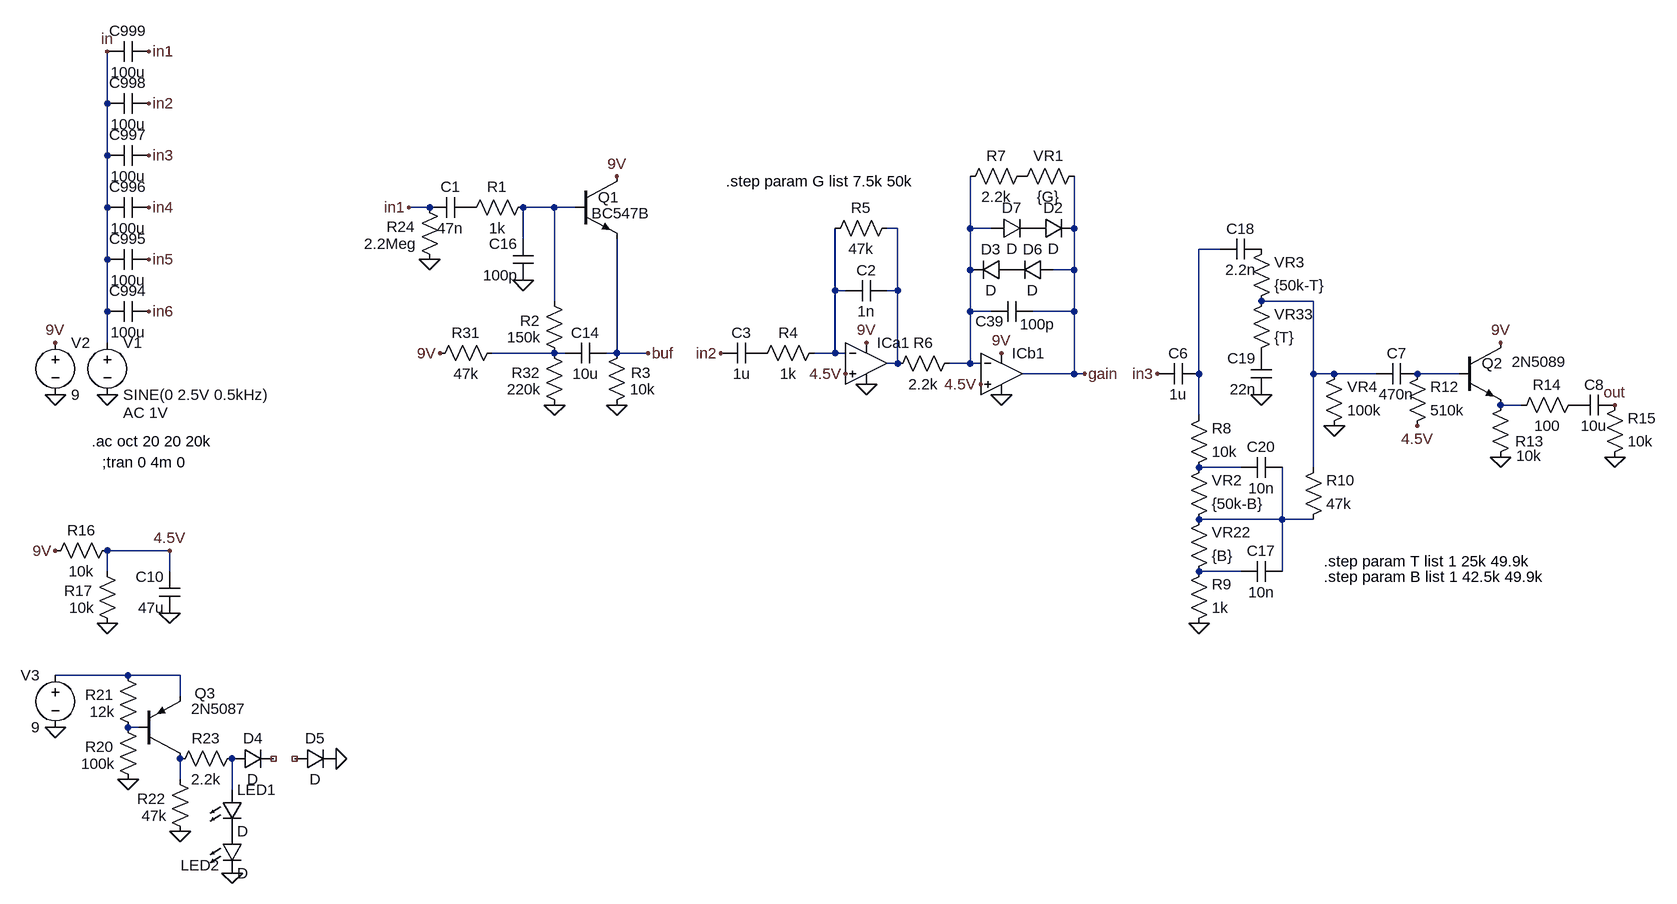
[diagram p0: schematic iron_forest.asc]
iron_forest.asc, the LTspice schematic file:
Version 4
SHEET 1 3200 3460
WIRE -1568 704 -1568 624
WIRE -1568 784 -1568 704
WIRE -1568 864 -1568 784
WIRE -1072 864 -1104 864
WIRE -880 864 -928 864
WIRE -848 864 -880 864
WIRE -352 896 -368 896
WIRE -240 896 -240 816
WIRE -208 896 -240 896
WIRE -80 896 -80 816
WIRE -928 912 -928 864
WIRE 144 928 112 928
WIRE -1568 944 -1568 864
WIRE -240 960 -240 896
WIRE -80 960 -80 896
WIRE -80 960 -112 960
WIRE -448 992 -448 896
WIRE -432 992 -448 992
WIRE -352 992 -352 896
WIRE -352 992 -368 992
WIRE -880 1008 -880 864
WIRE 288 1008 208 1008
WIRE -1568 1024 -1568 944
WIRE -240 1024 -240 960
WIRE -208 1024 -240 1024
WIRE -80 1024 -80 960
WIRE -80 1024 -144 1024
WIRE -1568 1072 -1568 1024
WIRE -880 1088 -976 1088
WIRE -864 1088 -880 1088
WIRE -784 1088 -784 912
WIRE -784 1088 -800 1088
WIRE -736 1088 -784 1088
WIRE -448 1088 -448 992
WIRE -448 1088 -480 1088
WIRE -432 1088 -448 1088
WIRE -352 1104 -352 992
WIRE -352 1104 -368 1104
WIRE -240 1104 -240 1024
WIRE -240 1104 -272 1104
WIRE -224 1104 -240 1104
WIRE -80 1120 -80 1024
WIRE -80 1120 -160 1120
WIRE -64 1120 -80 1120
WIRE 112 1120 112 928
WIRE 288 1120 288 1008
WIRE 320 1120 288 1120
WIRE 384 1120 320 1120
WIRE 512 1120 448 1120
WIRE 608 1168 576 1168
WIRE 112 1184 112 1120
WIRE 176 1264 112 1264
WIRE 288 1264 288 1120
WIRE 240 1344 240 1264
WIRE 240 1344 112 1344
WIRE 288 1344 240 1344
WIRE -1472 1392 -1568 1392
WIRE -1568 1424 -1568 1392
WIRE -1472 1424 -1472 1392
WIRE 176 1424 112 1424
WIRE 240 1424 240 1344
WIRE -1536 1584 -1648 1584
WIRE -1456 1584 -1536 1584
WIRE -1456 1616 -1456 1584
WIRE -1520 1664 -1536 1664
WIRE -1456 1744 -1456 1712
WIRE -1376 1760 -1376 1712
FLAG -1568 1152 0
FLAG -1568 624 in
FLAG -1648 1152 0
FLAG -1648 1072 9V
FLAG -1504 624 in1
FLAG -1504 704 in2
FLAG -1504 784 in3
FLAG -1504 864 in4
FLAG -1504 944 in5
FLAG -1504 1024 in6
FLAG -1072 944 0
FLAG -1104 864 in1
FLAG 208 1152 0
FLAG 48 1120 in3
FLAG 112 1504 0
FLAG 320 1200 0
FLAG -928 976 0
FLAG -880 1168 0
FLAG -784 1168 0
FLAG -784 816 9V
FLAG -1056 1088 9V
FLAG -1648 1392 9V
FLAG -1568 1504 0
FLAG -1472 1488 0
FLAG -1472 1392 4.5V
FLAG -432 1120 4.5V
FLAG -400 1072 9V
FLAG -400 1136 0
FLAG -224 1136 4.5V
FLAG -192 1088 9V
FLAG -192 1152 0
FLAG 448 1200 4.5V
FLAG 576 1072 9V
FLAG 576 1248 0
FLAG 752 1248 0
FLAG -624 1088 in2
FLAG -736 1088 buf
FLAG -64 1120 gain
FLAG 752 1168 out
FLAG -1536 1744 0
FLAG -1456 1824 0
FLAG -1216 1712 0
FLAG -1376 1888 0
FLAG -1648 1664 0
SYMBOL voltage -1568 1056 R0
WINDOW 123 24 124 Left 2
WINDOW 39 0 0 Left 2
SYMATTR Value2 AC 1V
SYMATTR InstName V1
SYMATTR Value SINE(0 2.5V 0.5kHz)
SYMBOL voltage -1648 1056 R0
WINDOW 123 0 0 Left 0
WINDOW 39 0 0 Left 0
SYMATTR InstName V2
SYMATTR Value 9
SYMBOL cap -1504 688 R90
WINDOW 0 0 32 VBottom 2
WINDOW 3 32 32 VTop 2
SYMATTR InstName C998
SYMATTR Value 100u
SYMBOL cap -1504 768 R90
WINDOW 0 0 32 VBottom 2
WINDOW 3 32 32 VTop 2
SYMATTR InstName C997
SYMATTR Value 100u
SYMBOL cap -1504 848 R90
WINDOW 0 0 32 VBottom 2
WINDOW 3 32 32 VTop 2
SYMATTR InstName C996
SYMATTR Value 100u
SYMBOL cap -1504 608 R90
WINDOW 0 0 32 VBottom 2
WINDOW 3 32 32 VTop 2
SYMATTR InstName C999
SYMATTR Value 100u
SYMBOL cap -1504 928 R90
WINDOW 0 0 32 VBottom 2
WINDOW 3 32 32 VTop 2
SYMATTR InstName C995
SYMATTR Value 100u
SYMBOL cap -1504 1008 R90
WINDOW 0 0 32 VBottom 2
WINDOW 3 32 32 VTop 2
SYMATTR InstName C994
SYMATTR Value 100u
SYMBOL cap -1008 848 R90
WINDOW 0 0 32 VBottom 2
WINDOW 3 32 32 VTop 2
SYMATTR InstName C1
SYMATTR Value 47n
SYMBOL res -1056 960 R180
WINDOW 0 38 66 Left 2
WINDOW 3 36 40 Left 2
SYMATTR InstName R24
SYMATTR Value 2.2Meg
SYMBOL npn -848 816 R0
WINDOW 0 35 32 Left 2
WINDOW 3 25 57 Left 2
SYMATTR InstName Q1
SYMATTR Value BC547B
SYMBOL cap 112 1104 R90
WINDOW 0 0 32 VBottom 2
WINDOW 3 32 32 VTop 2
SYMATTR InstName C6
SYMATTR Value 1u
SYMBOL cap 208 912 R90
WINDOW 0 0 32 VBottom 2
WINDOW 3 32 32 VTop 2
SYMATTR InstName C18
SYMATTR Value 2.2n
SYMBOL res 192 1024 M180
WINDOW 0 36 76 Left 2
WINDOW 3 36 40 Left 2
SYMATTR InstName VR3
SYMATTR Value {50k-T}
SYMBOL res 192 1104 M180
WINDOW 0 36 76 Left 2
WINDOW 3 36 40 Left 2
SYMATTR InstName VR33
SYMATTR Value {T}
SYMBOL cap 224 1152 R180
WINDOW 0 24 56 Left 2
WINDOW 3 24 8 Left 2
SYMATTR InstName C19
SYMATTR Value 22n
SYMBOL res 96 1280 M180
WINDOW 0 36 76 Left 2
WINDOW 3 36 40 Left 2
SYMATTR InstName R8
SYMATTR Value 10k
SYMBOL res 96 1360 M180
WINDOW 0 36 76 Left 2
WINDOW 3 36 40 Left 2
SYMATTR InstName VR2
SYMATTR Value {50k-B}
SYMBOL res 96 1440 M180
WINDOW 0 36 76 Left 2
WINDOW 3 36 40 Left 2
SYMATTR InstName VR22
SYMATTR Value {B}
SYMBOL res 96 1520 M180
WINDOW 0 36 76 Left 2
WINDOW 3 36 40 Left 2
SYMATTR InstName R9
SYMATTR Value 1k
SYMBOL cap 240 1248 R90
WINDOW 0 0 32 VBottom 2
WINDOW 3 32 32 VTop 2
SYMATTR InstName C20
SYMATTR Value 10n
SYMBOL cap 240 1408 R90
WINDOW 0 0 32 VBottom 2
WINDOW 3 32 32 VTop 2
SYMATTR InstName C17
SYMATTR Value 10n
SYMBOL res 304 1216 M180
WINDOW 0 36 76 Left 2
WINDOW 3 36 40 Left 2
SYMATTR InstName VR4
SYMATTR Value 100k
SYMBOL res 272 1360 M180
WINDOW 0 36 76 Left 2
WINDOW 3 36 40 Left 2
SYMATTR InstName R10
SYMATTR Value 47k
SYMBOL res -912 848 R90
WINDOW 0 0 56 VBottom 2
WINDOW 3 32 56 VTop 2
SYMATTR InstName R1
SYMATTR Value 1k
SYMBOL cap -912 976 R180
WINDOW 0 24 56 Left 2
WINDOW 3 24 8 Left 2
SYMATTR InstName C16
SYMATTR Value 100p
SYMBOL res -960 1072 R90
WINDOW 0 0 56 VBottom 2
WINDOW 3 32 56 VTop 2
SYMATTR InstName R31
SYMATTR Value 47k
SYMBOL res -864 1184 R180
WINDOW 0 38 66 Left 2
WINDOW 3 36 40 Left 2
SYMATTR InstName R32
SYMATTR Value 220k
SYMBOL cap -800 1072 R90
WINDOW 0 0 32 VBottom 2
WINDOW 3 32 32 VTop 2
SYMATTR InstName C14
SYMATTR Value 10u
SYMBOL res -800 1184 M180
WINDOW 0 38 66 Left 2
WINDOW 3 36 40 Left 2
SYMATTR InstName R3
SYMATTR Value 10k
SYMBOL cap -560 1072 R90
WINDOW 0 0 32 VBottom 2
WINDOW 3 32 32 VTop 2
SYMATTR InstName C3
SYMATTR Value 1u
SYMBOL res -464 1072 R90
WINDOW 0 0 56 VBottom 2
WINDOW 3 32 56 VTop 2
SYMATTR InstName R4
SYMATTR Value 1k
SYMBOL Opamps\\UniversalOpamp2 -400 1104 R0
SYMATTR InstName ICa1
SYMBOL res -1552 1376 R90
WINDOW 0 0 56 VBottom 2
WINDOW 3 32 56 VTop 2
SYMATTR InstName R16
SYMATTR Value 10k
SYMBOL res -1552 1520 R180
WINDOW 0 38 66 Left 2
WINDOW 3 36 40 Left 2
SYMATTR InstName R17
SYMATTR Value 10k
SYMBOL cap -1456 1488 R180
WINDOW 0 24 56 Left 2
WINDOW 3 24 8 Left 2
SYMATTR InstName C10
SYMATTR Value 47u
SYMBOL cap -368 976 R90
WINDOW 0 0 32 VBottom 2
WINDOW 3 32 32 VTop 2
SYMATTR InstName C2
SYMATTR Value 1n
SYMBOL res -352 880 R90
WINDOW 0 0 56 VBottom 2
WINDOW 3 32 56 VTop 2
SYMATTR InstName R5
SYMATTR Value 47k
SYMBOL res -256 1088 R90
WINDOW 0 0 56 VBottom 2
WINDOW 3 32 56 VTop 2
SYMATTR InstName R6
SYMATTR Value 2.2k
SYMBOL Opamps\\UniversalOpamp2 -192 1120 R0
SYMATTR InstName ICb1
SYMBOL cap -144 1008 R90
WINDOW 0 47 66 VBottom 2
WINDOW 3 20 -7 VTop 2
SYMATTR InstName C39
SYMATTR Value 100p
SYMBOL res -144 800 R90
WINDOW 0 0 56 VBottom 2
WINDOW 3 32 56 VTop 2
SYMATTR InstName R7
SYMATTR Value 2.2k
SYMBOL diode -208 912 R270
WINDOW 0 32 32 VTop 2
WINDOW 3 0 32 VBottom 2
SYMATTR InstName D7
SYMBOL diode -144 912 R270
WINDOW 0 32 32 VTop 2
WINDOW 3 0 32 VBottom 2
SYMATTR InstName D2
SYMBOL diode -176 976 M270
WINDOW 0 32 32 VTop 2
WINDOW 3 0 32 VBottom 2
SYMATTR InstName D3
SYMBOL diode -112 976 M270
WINDOW 0 32 32 VTop 2
WINDOW 3 0 32 VBottom 2
SYMATTR InstName D6
SYMBOL res -64 800 R90
WINDOW 0 0 56 VBottom 2
WINDOW 3 32 56 VTop 2
SYMATTR InstName VR1
SYMATTR Value {G}
SYMBOL cap 448 1104 R90
WINDOW 0 0 32 VBottom 2
WINDOW 3 32 32 VTop 2
SYMATTR InstName C7
SYMATTR Value 470n
SYMBOL res 432 1216 M180
WINDOW 0 36 76 Left 2
WINDOW 3 36 40 Left 2
SYMATTR InstName R12
SYMATTR Value 510k
SYMBOL npn 512 1072 R0
WINDOW 0 35 32 Left 2
WINDOW 3 81 29 Left 2
SYMATTR InstName Q2
SYMATTR Value 2N5089
SYMBOL res 560 1264 M180
WINDOW 0 39 40 Left 2
WINDOW 3 40 18 Left 2
SYMATTR InstName R13
SYMATTR Value 10k
SYMBOL res 704 1152 R90
WINDOW 0 0 56 VBottom 2
WINDOW 3 32 56 VTop 2
SYMATTR InstName R14
SYMATTR Value 100
SYMBOL cap 752 1152 R90
WINDOW 0 0 32 VBottom 2
WINDOW 3 32 32 VTop 2
SYMATTR InstName C8
SYMATTR Value 10u
SYMBOL res 736 1264 M180
WINDOW 0 36 76 Left 2
WINDOW 3 36 40 Left 2
SYMATTR InstName R15
SYMATTR Value 10k
SYMBOL res -864 1104 R180
WINDOW 0 38 66 Left 2
WINDOW 3 36 40 Left 2
SYMATTR InstName R2
SYMATTR Value 150k
SYMBOL pnp -1520 1712 M180
WINDOW 0 86 101 Left 2
WINDOW 3 81 77 Left 2
SYMATTR InstName Q3
SYMATTR Value 2N5087
SYMBOL res -1520 1680 R180
WINDOW 0 38 66 Left 2
WINDOW 3 36 40 Left 2
SYMATTR InstName R21
SYMATTR Value 12k
SYMBOL res -1520 1760 R180
WINDOW 0 38 66 Left 2
WINDOW 3 36 40 Left 2
SYMATTR InstName R20
SYMATTR Value 100k
SYMBOL res -1440 1840 R180
WINDOW 0 38 66 Left 2
WINDOW 3 36 40 Left 2
SYMATTR InstName R22
SYMATTR Value 47k
SYMBOL res -1472 1728 R270
WINDOW 0 32 56 VTop 2
WINDOW 3 0 56 VBottom 2
SYMATTR InstName R23
SYMATTR Value 2.2k
SYMBOL diode -1376 1728 R270
WINDOW 0 32 32 VTop 2
WINDOW 3 0 32 VBottom 2
SYMATTR InstName D4
SYMBOL diode -1280 1728 R270
WINDOW 0 32 32 VTop 2
WINDOW 3 0 32 VBottom 2
SYMATTR InstName D5
SYMBOL LED -1392 1760 R0
SYMATTR InstName LED1
SYMBOL voltage -1648 1568 M0
WINDOW 123 0 0 Left 0
WINDOW 39 0 0 Left 0
SYMATTR InstName V3
SYMATTR Value 9
SYMBOL LED -1392 1824 R0
WINDOW 0 -63 52 Left 2
SYMATTR InstName LED2
TEXT -1592 1224 Left 2 !.ac oct 20 20 20k
TEXT -1576 1256 Left 2 !;tran 0 4m 0
TEXT 304 1432 Left 2 !.step param B list 1 42.5k 49.9k
TEXT -616 824 Left 2 !.step param G list 7.5k 50k
TEXT 304 1408 Left 2 !.step param T list 1 25k 49.9k

The netlist it stands for:
* iron_forest.asc
V1 in 0 SINE(0 2.5V 0.5kHz) AC 1V
V2 9V 0 9
C998 in2 in 100u
C997 in3 in 100u
C996 in4 in 100u
C999 in1 in 100u
C995 in5 in 100u
C994 in6 in 100u
C1 P001 in1 47n
R24 0 in1 2.2Meg
Q1 9V N001 buf 0 BC547B
C6 N004 in3 1u
C18 P002 N004 2.2n
R§VR3 N006 P002 {50k-T}
R§VR33 P003 N006 {T}
C19 0 P003 22n
R8 N010 N004 10k
R§VR2 N011 N010 {50k-B}
R§VR22 N012 N011 {B}
R9 0 N012 1k
C20 N011 N010 10n
C17 N011 N012 10n
R§VR4 0 N006 100k
R10 N011 N006 47k
R1 N001 P001 1k
C16 0 N001 100p
R31 N007 9V 47k
R32 0 N007 220k
C14 buf N007 10u
R3 0 buf 10k
C3 P004 in2 1u
R4 N005 P004 1k
XICa1 4.5V N005 9V 0 N002 level.2 Avol=1Meg GBW=10Meg Slew=10Meg ilimit=25m rail=0 Vos=0 phimargin=45 en=0 enk=0 in=0 ink=0 Rin=500Meg  ; pins IN+ IN- V+ V- OUT
R16 4.5V 9V 10k
R17 0 4.5V 10k
C10 0 4.5V 47u
C2 N002 N005 1n
R5 N002 N005 47k
R6 N003 N002 2.2k
XICb1 4.5V N003 9V 0 gain level.2 Avol=1Meg GBW=10Meg Slew=10Meg ilimit=25m rail=0 Vos=0 phimargin=45 en=0 enk=0 in=0 ink=0 Rin=500Meg  ; pins IN+ IN- V+ V- OUT
C39 gain N003 100p
R7 P005 N003 2.2k
D7 N003 P006 D
D2 P006 gain D
D3 P007 N003 D
D6 gain P007 D
R§VR1 gain P005 {G}
C7 N008 N006 470n
R12 4.5V N008 510k
Q2 9V N008 N009 0 2N5089
R13 0 N009 10k
R14 P008 N009 100
C8 out P008 10u
R15 0 out 10k
R2 N007 N001 150k
Q3 N015 N014 N013 0 2N5087
R21 N014 N013 12k
R20 0 N014 100k
R22 0 N015 47k
R23 N015 N016 2.2k
D4 N016 NC_01 D
D5 NC_02 0 D
D§LED1 N016 P009 D
V3 N013 0 9
D§LED2 P009 0 D
.model D D
.lib standard.dio
.model NPN NPN
.model PNP PNP
.lib standard.bjt
.ac oct 20 20 20k
;tran 0 4m 0
.step param B list 1 42.5k 49.9k
.step param G list 7.5k 50k
.step param T list 1 25k 49.9k
.lib UniversalOpamps2.sub
.backanno
.end